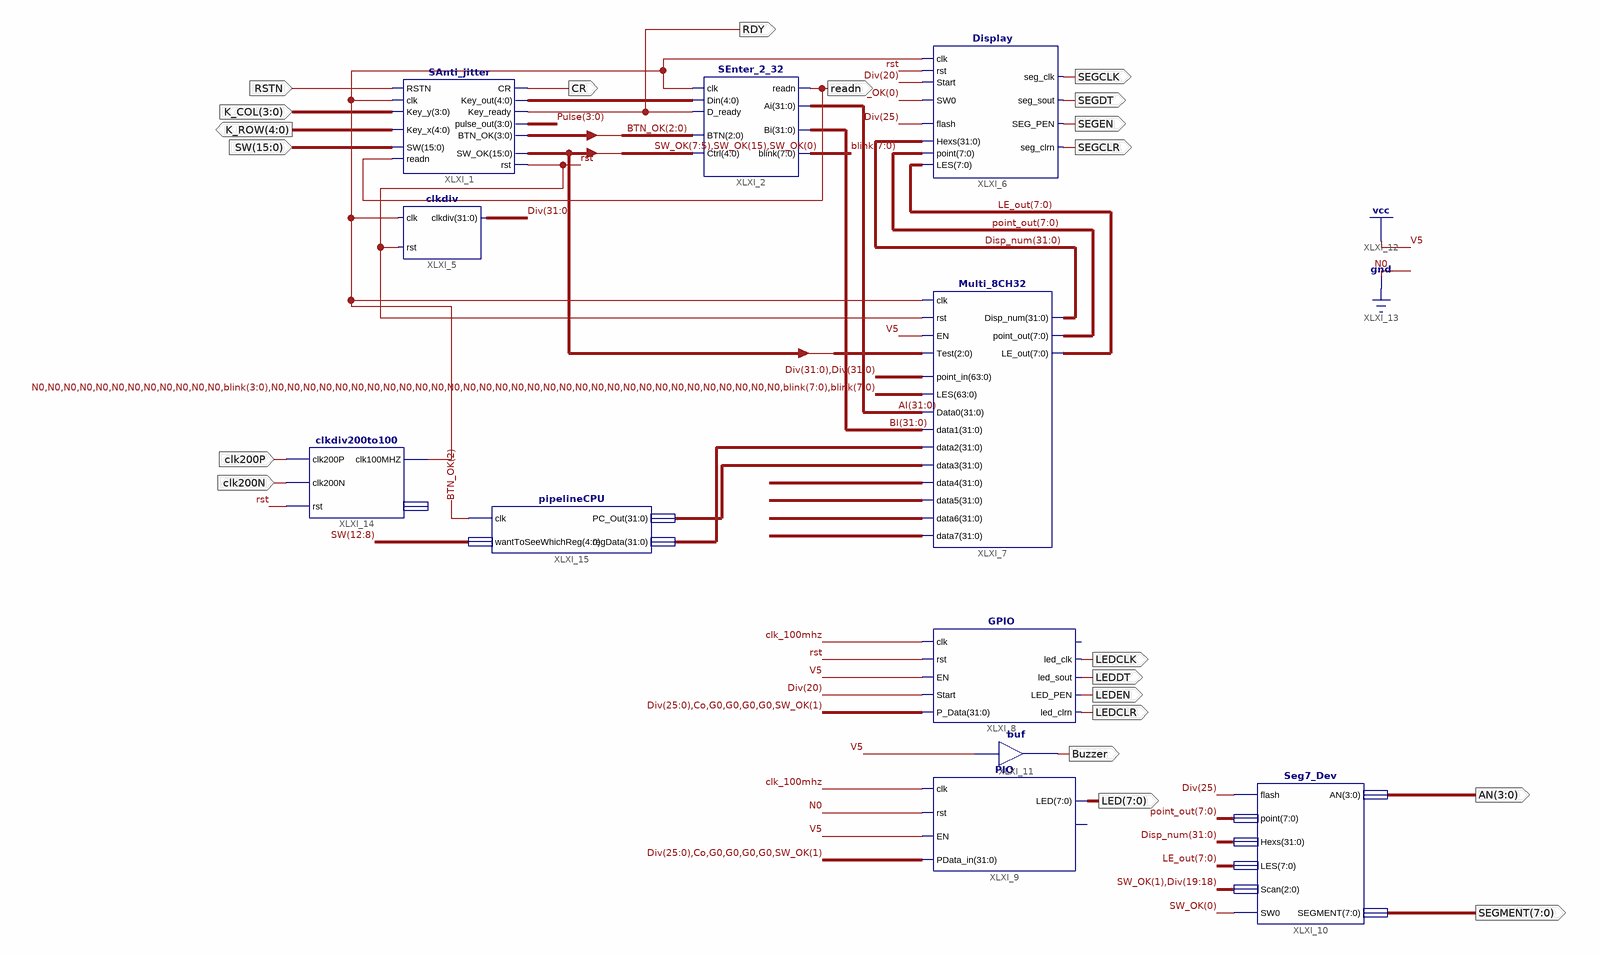
[diagram p0: schematic sheet 1]
// Xilinx ISE schematic Framework.sch (kintex7) as structural Verilog: 11 symbols, 21 ports
module Framework (
  input  RSTN,
  input  [3:0] K_COL,
  input  [15:0] SW,
  input  clk200P,
  input  clk200N,
  output [4:0] K_ROW,
  output CR,
  output RDY,
  output SEGCLK,
  output SEGDT,
  output SEGEN,
  output SEGCLR,
  output readn,
  output LEDCLK,
  output LEDDT,
  output LEDEN,
  output LEDCLR,
  output [7:0] LED,
  output Buzzer,
  output [3:0] AN,
  output [7:0] SEGMENT
);

  wire clk_100mhz, Co, G0, rst;
  wire [3:0] BTN_OK, Pulse;
  wire [4:0] XLXN_17;
  wire [7:0] blink, LE_out, point_out;
  wire [15:0] SW_OK;
  wire [31:0] AI, BI, Disp_num, Div, XLXN_84, XLXN_85, XLXN_86, XLXN_87, XLXN_88, XLXN_90;

  SAnti_jitter XLXI_1 (
    .SW(SW), .readn(readn), .Key_y(K_COL), .Key_x(K_ROW), .RSTN(RSTN), .clk(clk_100mhz), .Key_out(XLXN_17),
    .Key_ready(RDY), .CR(CR), .rst(rst), .SW_OK(SW_OK), .pulse_out(Pulse), .BTN_OK(BTN_OK));
  SEnter_2_32 XLXI_2 (
    .readn(readn), .Ai(AI), .Bi(BI), .blink(blink), .Din(XLXN_17), .D_ready(RDY), .clk(clk_100mhz),
    .Ctrl({SW_OK[7:5], SW_OK[15], SW_OK[0]}), .BTN(BTN_OK[2:0]));
  clkdiv XLXI_5 (.rst(rst), .clkdiv(Div), .clk(clk_100mhz));
  Display XLXI_6 (
    .LES(LE_out), .SEG_PEN(SEGEN), .seg_sout(SEGDT), .seg_clrn(SEGCLR), .point(point_out), .Hexs(Disp_num),
    .SW0(SW_OK[0]), .flash(Div[25]), .seg_clk(SEGCLK), .clk(clk_100mhz), .rst(rst), .Start(Div[20]));
  Multi_8CH32 XLXI_7 (
    .Test(SW_OK[7:5]), .point_in({Div, Div}), .EN(1'b1), .clk(clk_100mhz), .rst(rst),
    .LES({{12{1'b0}}, blink[3:0], {32{1'b0}}, blink, blink}), .Data0(AI), .data1(BI), .data2(XLXN_90),
    .data3(XLXN_84), .data4(XLXN_85), .data5(XLXN_86), .data6(XLXN_87), .data7(XLXN_88),
    .point_out(point_out), .LE_out(LE_out), .Disp_num(Disp_num));
  GPIO XLXI_8 (
    .clk(clk_100mhz), .P_Data({Div[25:0], Co, {4{G0}}, SW_OK[1]}), .rst(rst), .EN(1'b1), .Start(Div[20]),
    .led_clrn(LEDCLR), .led_clk(LEDCLK), .led_sout(LEDDT), .LED_PEN(LEDEN));  // open: GPIOf0
  PIO XLXI_9 (
    .clk(clk_100mhz), .rst(1'b0), .EN(1'b1), .PData_in({Div[25:0], Co, {4{G0}}, SW_OK[1]}), .LED(LED));  // open: GPIOf0
  Seg7_Dev XLXI_10 (
    .flash(Div[25]), .point(point_out), .Hexs(Disp_num), .LES(LE_out), .Scan({SW_OK[1], Div[19:18]}),
    .SW0(SW_OK[0]), .AN(AN), .SEGMENT(SEGMENT));
  buf XLXI_11 (Buzzer, 1'b1);
  clkdiv200to100 XLXI_14 (.clk200P(clk200P), .clk200N(clk200N), .rst(rst), .clk100MHZ(clk_100mhz));  // open: clkdiv
  pipelineCPU XLXI_15 (.clk(BTN_OK[2]), .wantToSeeWhichReg(SW[12:8]), .PC_Out(XLXN_84), .regData(XLXN_90));
endmodule
